# EasyEDA Pro project Magmattic PCB_V2.eprj, schematic Adafruit TPS65131 Split Power Supply
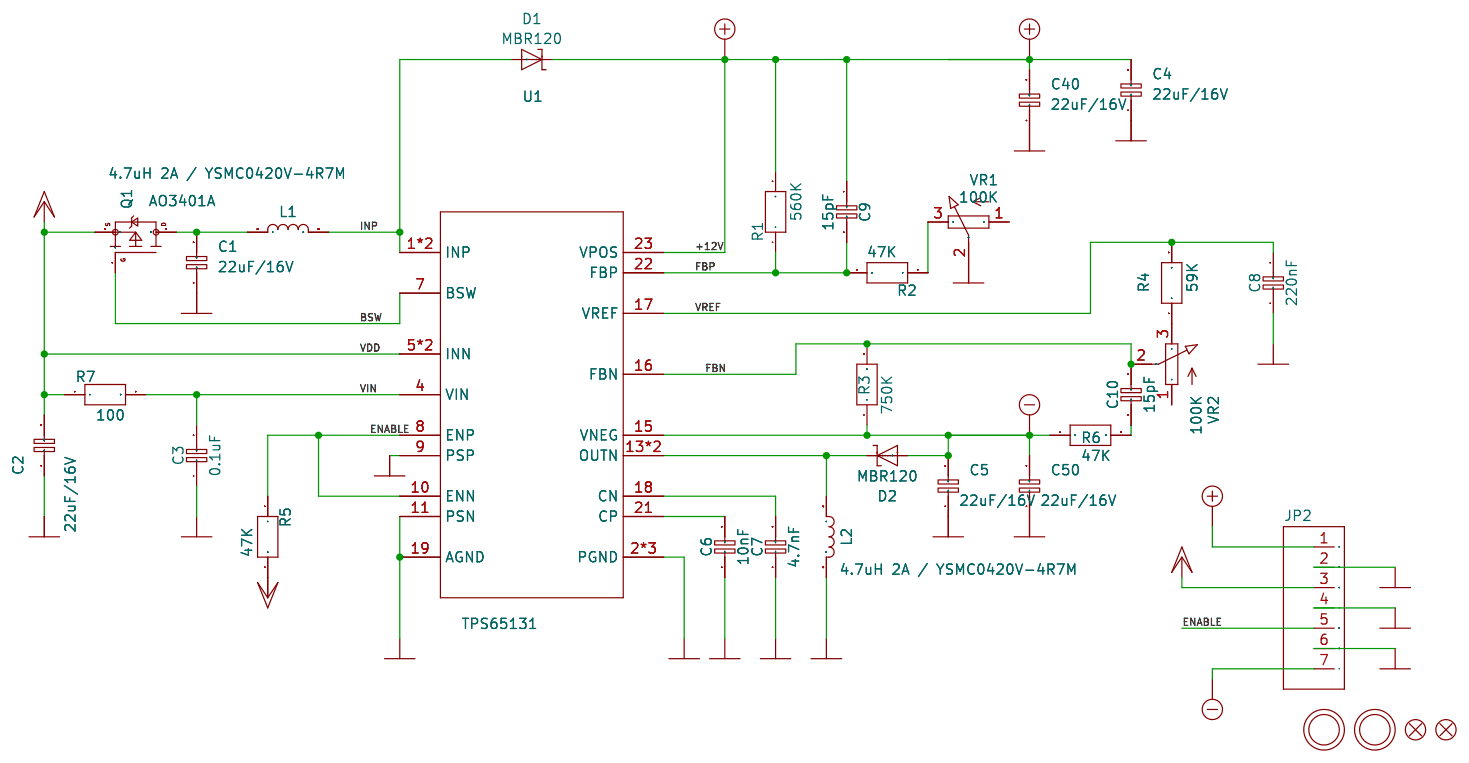
[diagram p3: schematic sheet]

## Parts
C1  22uF/16V  [0805-NO]
C2  22uF/16V  [0805-NO]
C3  0.1uF  [0603-NO]
C4  22uF/16V  [0805-NO]
C5  22uF/16V  [0805-NO]
C6  10nF  [0603-NO]
C7  4.7nF  [0603-NO]
C8  220nF  [0603-NO]
C9  15pF  [0603-NO]
C10  15pF  [0603-NO]
C40  22uF/16V  [0805-NO]
C50  22uF/16V  [0805-NO]
D1  MBR120  [SOD-123FL]
D2  MBR120  [SOD-123FL]
FID1  FIDUCIAL_0.5MM  [FIDUCIAL_0.5MM]
FID2  FIDUCIAL_0.5MM  [FIDUCIAL_0.5MM]
JP2  HEADER-1X7THICKER  [1X07_ROUND_76]
L1  4.7uH 2A / YSMC0420V-4R7M  [INDUCTOR_4X4MM_NR401]
L2  4.7uH 2A / YSMC0420V-4R7M  [INDUCTOR_4X4MM_NR401]
Q1  AO3401A  [SOT23-WIDE]
R1  560K  [0603-NO]
R2  47K  [0603-NO]
R3  750K  [0603-NO]
R4  59K  [0603-NO]
R5  47K  [0603-NO]
R6  47K  [0603-NO]
R7  100  [0603-NO]
U1  TPS65131  [QFN24_4MM]
U$1  MOUNTINGHOLE2.5  [MOUNTINGHOLE_2.5_PLATED]
U$2  MOUNTINGHOLE2.5  [MOUNTINGHOLE_2.5_PLATED]
VR1  100K  [TRIMPOT_BOURNS_TC33X-2]
VR2  100K  [TRIMPOT_BOURNS_TC33X-2]

## Library data of the parts
C1 C2 C4 C5 C40 C50 = microbuilder_CAP_CERAMIC_0805-NOOUTLINE
C3 C6-C10 = microbuilder_CAP_CERAMIC_0603_NO
D1 D2 = microbuilder_DIODE-SCHOTTKY_SOD-123FL
FID1 FID2 = microbuilder_FIDUCIAL__0.5MM
JP2 = microbuilder_HEADER-1X7_THICKER
L1 L2 = microbuilder_INDUCTOR_NR401
Q1 = microbuilder_MOSFET-P_WIDE
R1-R7 = microbuilder_RESISTOR__0603_NOOUT
U1 = adafruit_power_TPS6513X_
U$1 U$2 = adafruit_electromech_MOUNTINGHOLE_2.5
VR1 VR2 = microbuilder_TRIMPOT_TC33X-2

## Nets
+12V: C4.2 C9.1 C40.2 D1.C JP2.1 R1.2 U1.23(VPOS)
-12V: C5.2 C50.2 D2.A JP2.7 R3.1 R6.1 U1.15(VNEG)
GND: C1.1 C2.1 C3.1 C4.1 C5.1 C6.1 C7.1 C8.1 C40.1 C50.1 JP2.2 JP2.4 JP2.6 L2.P$2(2) U1.2*3(PGND) U1.9(PSP) U1.11(PSN) U1.19(AGND) VR1.2(S)
VDD: C2.2 JP2.3 Q1.2(S) R5.2 R7.1 U1.5*2(INN)
VIN: C3.2 R7.2 U1.4(VIN)
BSW: Q1.1(G) U1.7(BSW)
ENABLE: JP2.5 R5.1 U1.8(ENP) U1.10(ENN)
FBN: C10.2 R3.2 U1.16(FBN) VR2.2(S)
FBP: C9.2 R1.1 R2.2 U1.22(FBP)
INP: D1.A L1.P$2(2) U1.1*2(INP)
N$1: C6.2 U1.21(CP)
N$2: C1.2 L1.P$1(1) Q1.3(D)
N$3: R2.1 VR1.3(E)
N$4: R4.1 VR2.3(E)
N$5: C10.1 R6.2
N$17: C7.2 U1.18(CN)
OUTN: D2.C L2.P$1(1) U1.13*2(OUTN)
VREF: C8.2 R4.2 U1.17(VREF)

Not connected (* = marked no-connect by the designer): VR1 1(A); VR2 1(A)
